# EAGLE design esp8266-hw9 (EAGLE 9.5.2)
ESP8266 HW
CNAME: Sensorboard; CREVISION: HW7; DESIGNER: Pär Sundbäck
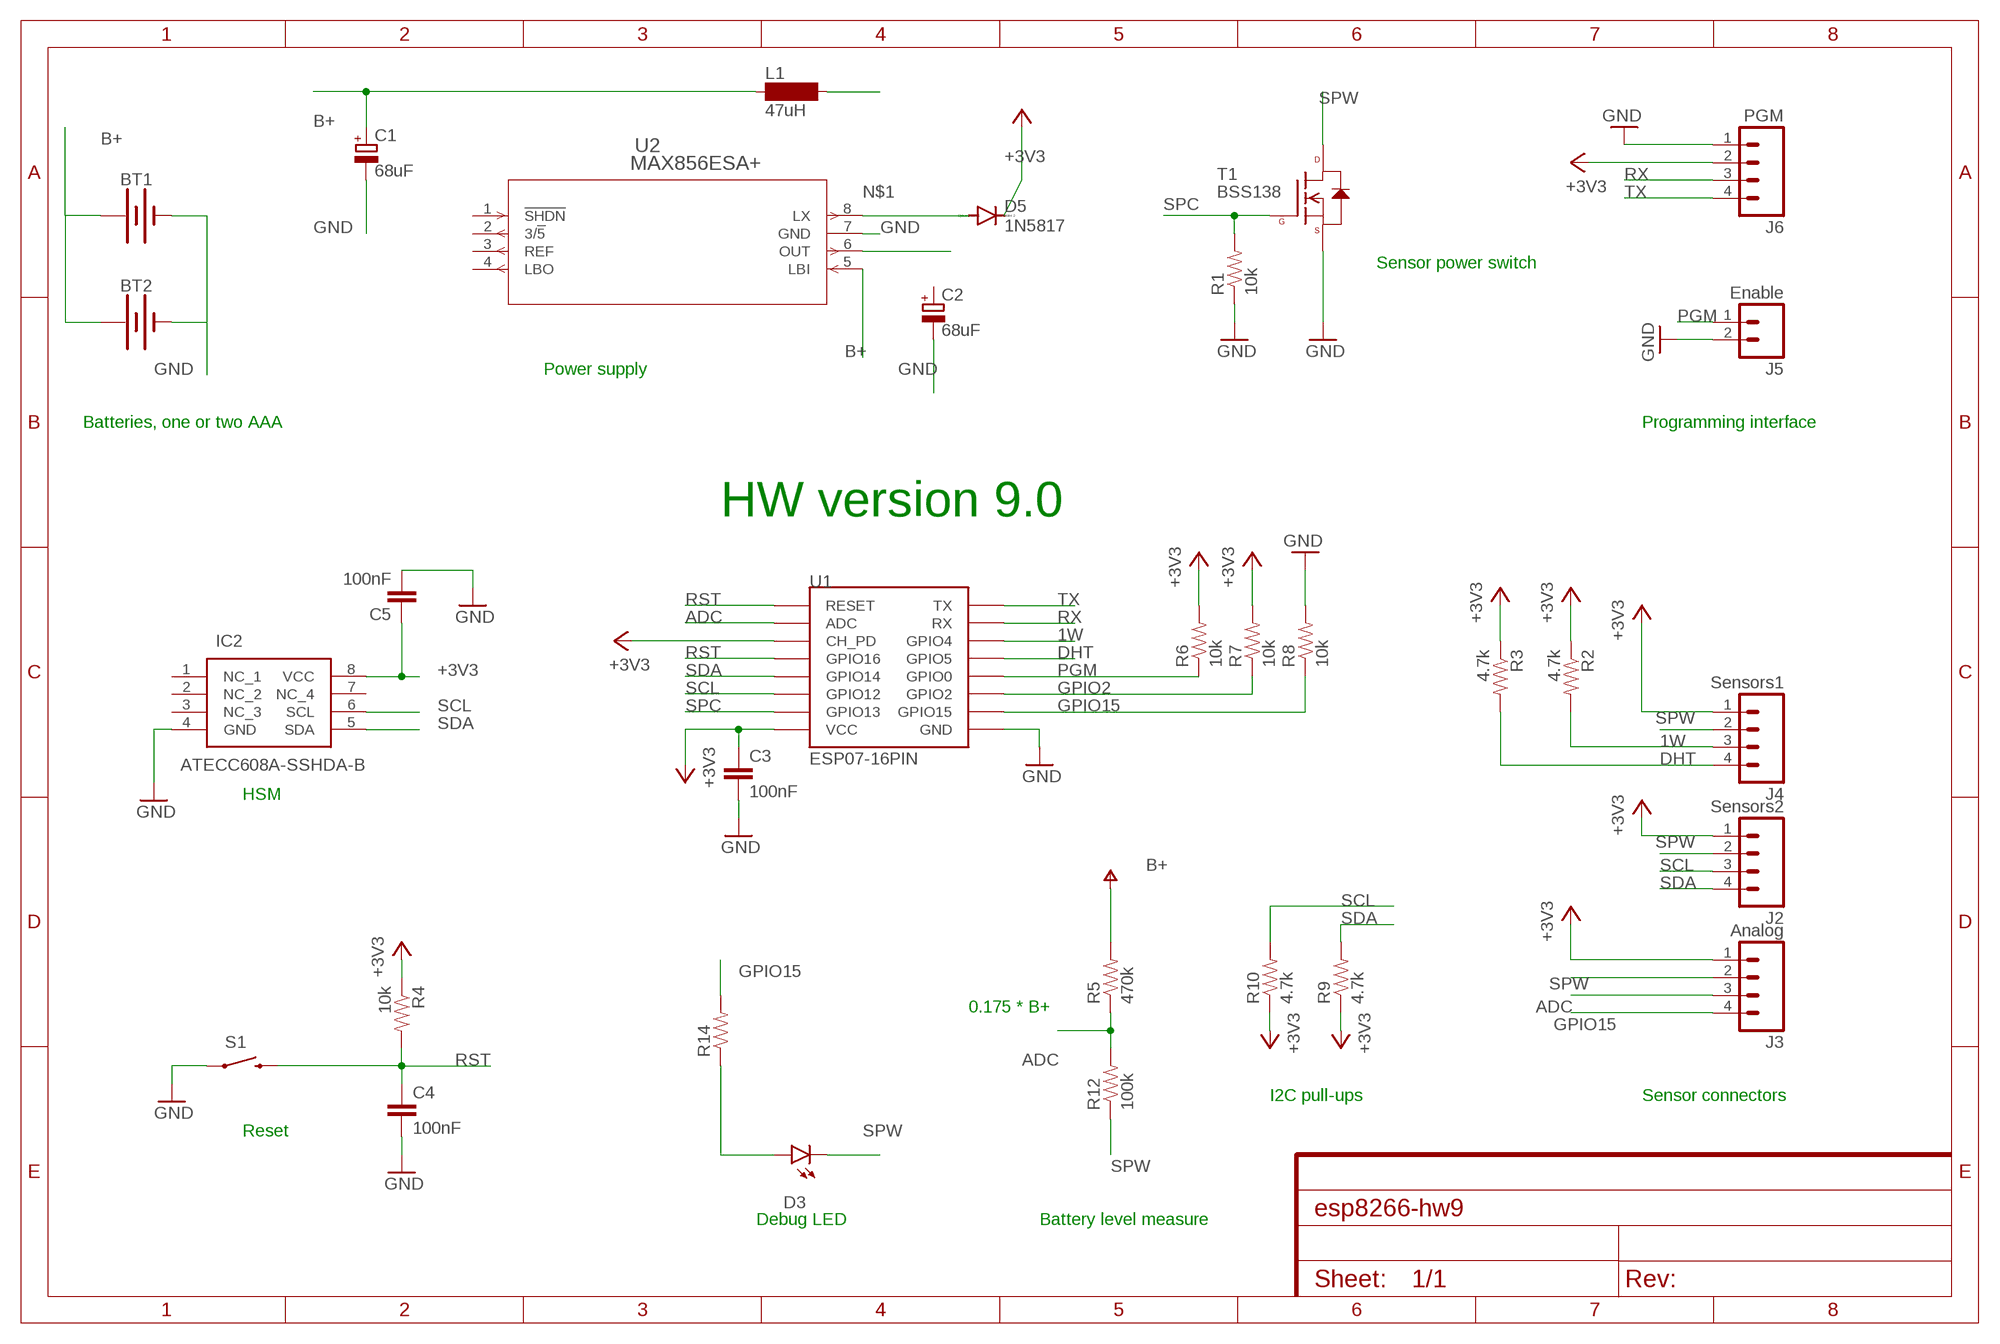
[diagram p0: schematic, sheet 1]

## Parts
BT1  BATTERY-AAA  [BATTERY-AAA]
BT2  BATTERY-AAA  [BATTERY-AAA]
C1  68uF  CPOL-EUE2.5-6  [E2,5-6]
C2  68uF  CPOL-EUE2.5-6  [E2,5-6]
C3  100nF  CAP0805  [0805]
C4  100nF  CAP0805  [0805]
C5  100nF  CAP0805  [0805]
D3  LED3MM  [LED_3MM]
D5  1N5817  DIODE-DO41-10  [DO41-10]
IC2  ATECC608A-SSHDA-B  [SOIC127P600X175-8N]
J2  Sensors2  M04PTH  [1X04]
J3  Analog  M04PTH  [1X04]
J4  Sensors1  M04PTH  [1X04]
J5  Enable  M02PTH  [1X02]
J6  PGM  M04PTH  [1X04]
L1  47uH  SM-1206  [SM-1206]
R1  10k  RESISTOR0805-RES  [0805]
R2  4.7k  RESISTOR0805-RES  [0805]
R3  4.7k  RESISTOR0805-RES  [0805]
R4  10k  RESISTOR0805-RES  [0805]
R5  470k  RESISTOR0805-RES  [0805]
R6  10k  RESISTOR0805-RES  [0805]
R7  10k  RESISTOR0805-RES  [0805]
R8  10k  RESISTOR0805-RES  [0805]
R9  4.7k  RESISTOR0805-RES  [0805]
R10  4.7k  RESISTOR0805-RES  [0805]
R12  100k  RESISTOR0805-RES  [0805]
R14  470  RESISTOR0805-RES  [0805]
S1  RESET  SWITCH-MOMENTARY-2SMD-1101NE  [TACTILE-SWITCH-1101NE]
T1  BSS138  N-CHANNEL-MOSFET-BSS138  [SOT23-3]
U1  ESP07-16PIN  [ESP07-16PIN]
U2  MAX856ESA+  [21-0041B_8]

## Nets
1W: J4.3 R2.2 U1.GPIO4
+3V3: C3.1 C5.1 D5.C IC2.8(VCC) J2.1 J3.1 J4.1 J6.2 R2.1 R3.1 R4.1 R6.2 R7.2 R9.1 R10.1 U1.CH_PD U1.VCC
ADC: J3.3 R5.1 R12.2 U1.ADC
B+: BT1.PWR@1(+) BT2.PWR@1(+) C1.+ L1.1 R5.2 U2.5(LBI) ; supply symbol labelled V+
DHT: J4.4 R3.2 U1.GPIO5
GND: BT1.GND@1(-) BT2.GND@1(-) C1.- C2.- C3.2 C4.2 C5.2 IC2.4(GND) J5.2 J6.1 R1.1 R8.2 S1.1 T1.2(S) U1.GND U2.7(GND)
GPIO2: R7.1 U1.GPIO2
GPIO15: J3.4 R8.1 R14.2 U1.GPIO15
LX: L1.2
N$1: D5.A U2.8(LX)
N$2: U2.6(OUT)
N$8: D3.A R14.1
PGM: J5.1 R6.1 U1.GPIO0
RST: C4.1 R4.2 S1.2 U1.GPIO16 U1.REST(RESET)
RX: J6.3 U1.RX
SCL: IC2.6(SCL) J2.3 R10.2 U1.GPIO12
SDA: IC2.5(SDA) J2.4 R9.2 U1.GPIO14
SPC: R1.2 T1.1(G) U1.GPIO13
SPW: D3.K(C) J2.2 J3.2 J4.2 R12.1 T1.3(D)
TX: J6.4 U1.TX
Unconnected: C2.+ IC2.1(NC_1) IC2.2(NC_2) IC2.3(NC_3) IC2.7(NC_4) U2.1(!SHDN) U2.2(3/!5) U2.3(REF) U2.4(LBO)

## Notes on the sheet
- Sensor power switch
- Power supply
- Batteries, one or two AAA | Programming interface
- HW version 9.0
- HSM
- 0.175 * B+
- I2C pull-ups | Sensor connectors
- Reset
- Debug LED | Battery level measure

## Library data of the parts
BT1 BT2 = SparkFun-Batteries:BATTERY: Battery - Single Cell A variety of battery chemistries, sizes, and footprints. Device List: 20MM_PTH - Coin Cell Battery Holder - 20mm (PTH) <https://www.sparkfun.com/products/783> 6.8MM_PTH - Coin Cell Battery Holder - 6.8MM(SMD) <https://www.digikey.com/product-detail/en/seiko-instruments/MS621FE-FL11E/728-1057-ND/1889208?WT.srch=1&gclid=CNOQ5a6LzdQCFZS2wAodXCkE0g> 12MM_SMD - Coin Cell Battery Holder - 12mm (SMD) <https://www.sparkfun.com/products/10592> 12MM_PTH - Coin Cell Battery Holder - 12mm (PTH) <https://www.sparkfun.com/products/7948> 20MM_SMD - 20mm Coin Cell Battery Holder (SMD) (2 legs) Used on the Big Time Watch Kit <https://www.sparkfun.com/products/11734> 20MM_SMD_4LEGS - Coin Cell Battery Holder - 20mm (SMD) <https://www.sparkfun.com/products/11892> 20MM_SMD_4LEGS_OVERPASTE - Coin Cell Battery Holder - 20mm (SMD) <https://www.sparkfun.com/products/11892> (Over-paste on the legs) 24.5MM_PTH - Coin Cell Battery Holder - 24.5mm (PTH) <https://www.sparkfun.com/products/8863> 9V - 9V Battery Holder - PC Mount Used on the SparkFun SparkPunk Sound Kit <https://www.sparkfun.com/products/11177> and SparkFun SparkPunk Sequencer Kit <https://www.sparkfun.com/products/12707> 18650 - Battery Holder - 18650 (PTH) <https://www.sparkfun.com/products/13113> AA - Battery Holder - 1xAA (PTH) <https://www.sparkfun.com/products/7949> AAA - Battery Holder - 1xAAA (PTH) <https://www.sparkfun.com/products/12718> AA_KIT - Battery Holder - 1xAA (PTH) <https://www.sparkfun.com/products/7949> Special kit package - pads only have exposed copper on one side of the board. AAA_KIT - Battery Holder - 1xAAA (PTH) <https://www.sparkfun.com/products/12718> Special kit package - pads only have exposed copper on one side of the board.; PROD_ID: BATT-08571; SF_SKU: PRT-12718
C1 C2 = resistor:CPOL-EU: POLARIZED CAPACITOR, European symbol
C3-C5 = SparkFun-Passives:CAP: Capacitor Standard 0603 ceramic capacitor, and 0.1" leaded capacitor.
D3 = SparkFun-LED:LED: LED (Generic) Standard schematic elements and footprints for 5mm, 3mm, 1206, and 0603 sized LEDs. Generic LEDs with no color specified.; PROD_ID: DIO-08794
D5 = diode:DIODE-: DIODE
IC2 = SamacSys_Parts:ATECC608A-SSHDA-B: Cryptoathentication ECC608A SOIC Source: Datasheet <https://componentsearchengine.com/Datasheets/1/ATECC608A-SSHDA-B.pdf>; DESCRIPTION: Cryptoathentication ECC608A SOIC; HEIGHT: 1.75mm; MANUFACTURER_NAME: Microchip; MANUFACTURER_PART_NUMBER: ATECC608A-SSHDA-B; MOUSER_PART_NUMBER: 556-ATECC608ASSHDAB; MOUSER_PRICE-STOCK: https://www.mouser.com/Search/Refine.aspx?Keyword=556-ATECC608ASSHDAB
J2-J4 J6 = SparkFun-Connectors:M04: Header 4 Standard 4-pin 0.1" header. Use with straight break away headers (SKU : PRT-00116), right angle break away headers (PRT-00553), swiss pins (PRT-00743), machine pins (PRT-00117), and female headers (PRT-00115). Molex polarized connector foot print use with SKU : PRT-08231 with associated crimp pins and housings. 1MM SMD Version SKU: PRT-10208; PROD_ID: CONN-09696
J5 = SparkFun-Connectors:M02: Standard 2-pin 0.1" header. Use with - straight break away headers ( PRT-00116) - right angle break away headers (PRT-00553) - swiss pins (PRT-00743) - machine pins (PRT-00117) - female headers (PRT-00115) Molex polarized connector foot print use with: PRT-08233 with associated crimp pins and housings. 2.54_SCREWTERM for use with PRT-10571. 3.5mm Screw Terminal footprints for PRT-08084 5mm Screw Terminal footprints for use with PRT-08432
L1 = inductor-neosid:SM-1206: INDUCTOR SMD chip inductor; OC_FARNELL: unknown; OC_NEWARK: unknown
R1-R10 R12 R14 = SparkFun-Resistors:RESISTOR: Resistor Basic schematic elements and footprints for 0603, 1206, and PTH resistors.
S1 = SparkFun-Electromechanical:SWITCH-MOMENTARY-2: Various NO switches- pushbuttons, reed, etc; PROD_ID: SWCH-00815
T1 = GeekAmmo:N-CHANNEL-MOSFET: N-Channel MOSFET Mode Field Effect Transistor; DATASHEET: http://www.fairchildsemi.com/ds/BS/BSS138.pdf; DIGIKEY: BSS138TR-ND; ELEMENT14: 2323154; URL: http://au.element14.com/fairchild-semiconductor/bss138/mosfet-n-ch-50v-220ma-sot-23/dp/2323154
U1 = esp8266modules:ESP07-16PIN: ESP8266 Wifi module 07 - 16 pins; DIMENSIONS: 22.0 x 16.0 mm; PINS: 16; PITCH: 0.078" / 2 mm
U2 = max856:MAX856ESA+; MANUFACTURER_PART_NUMBER: MAX856ESA+; VENDOR: Maxim Integrated Products

## Board
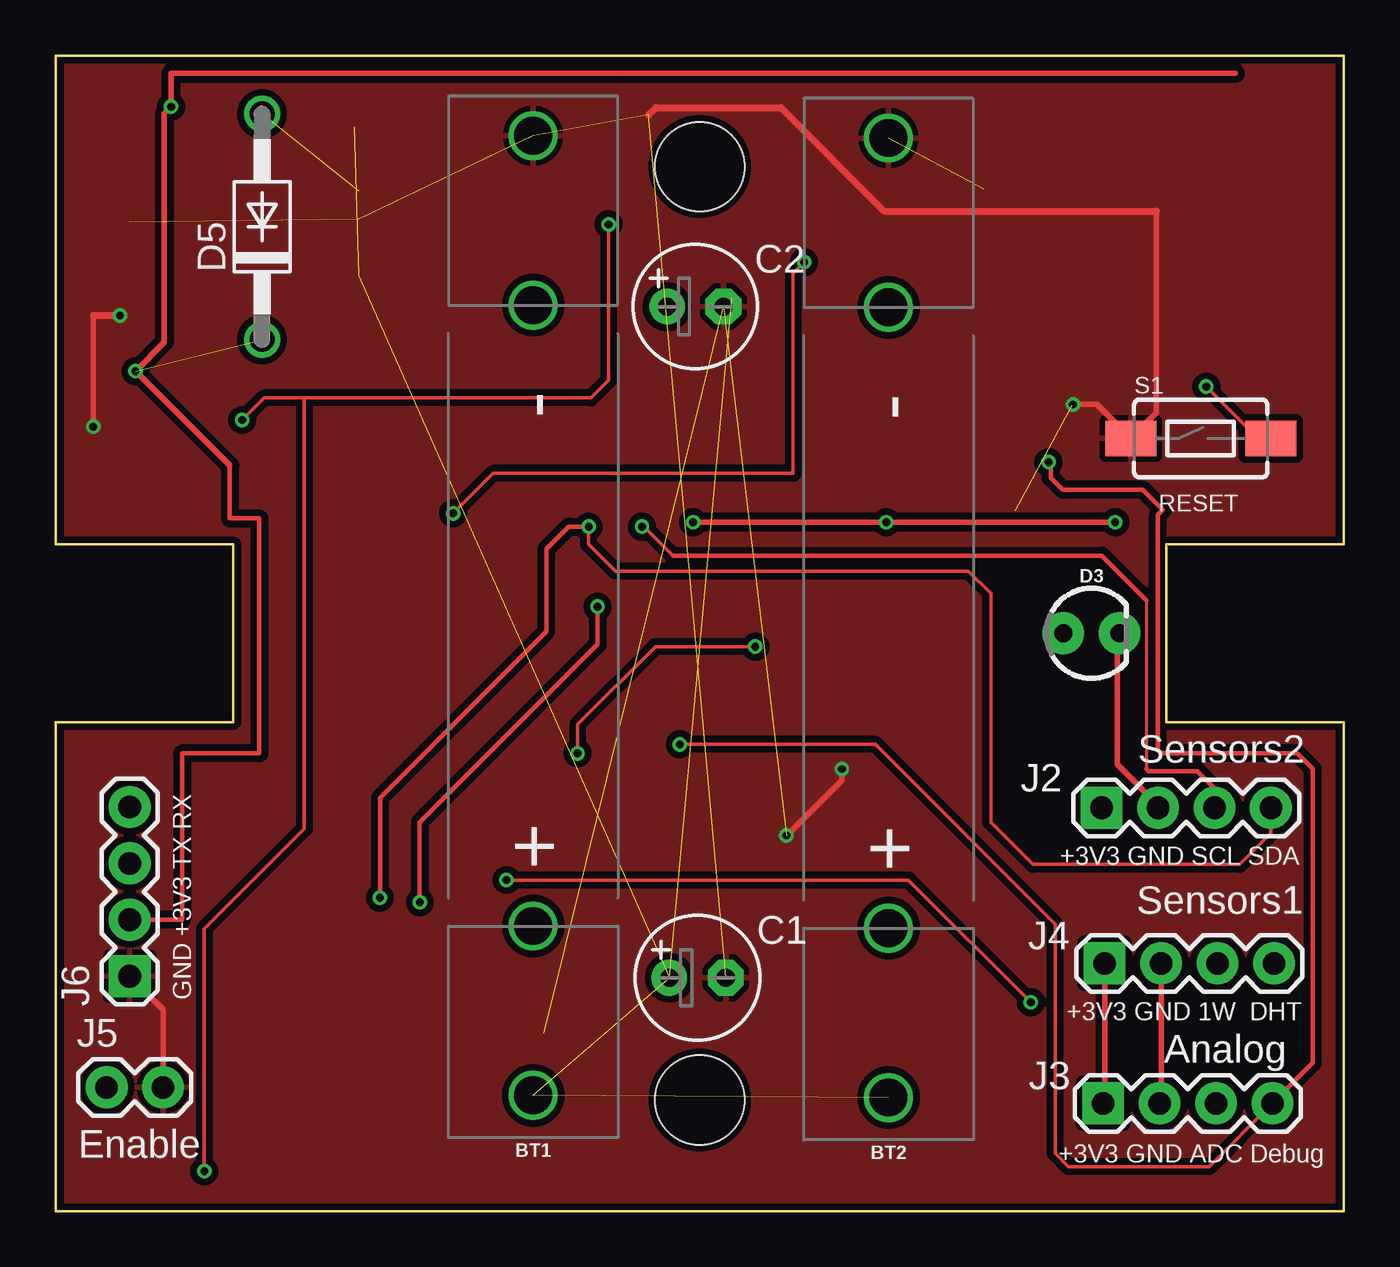
[diagram p1: board, top side]
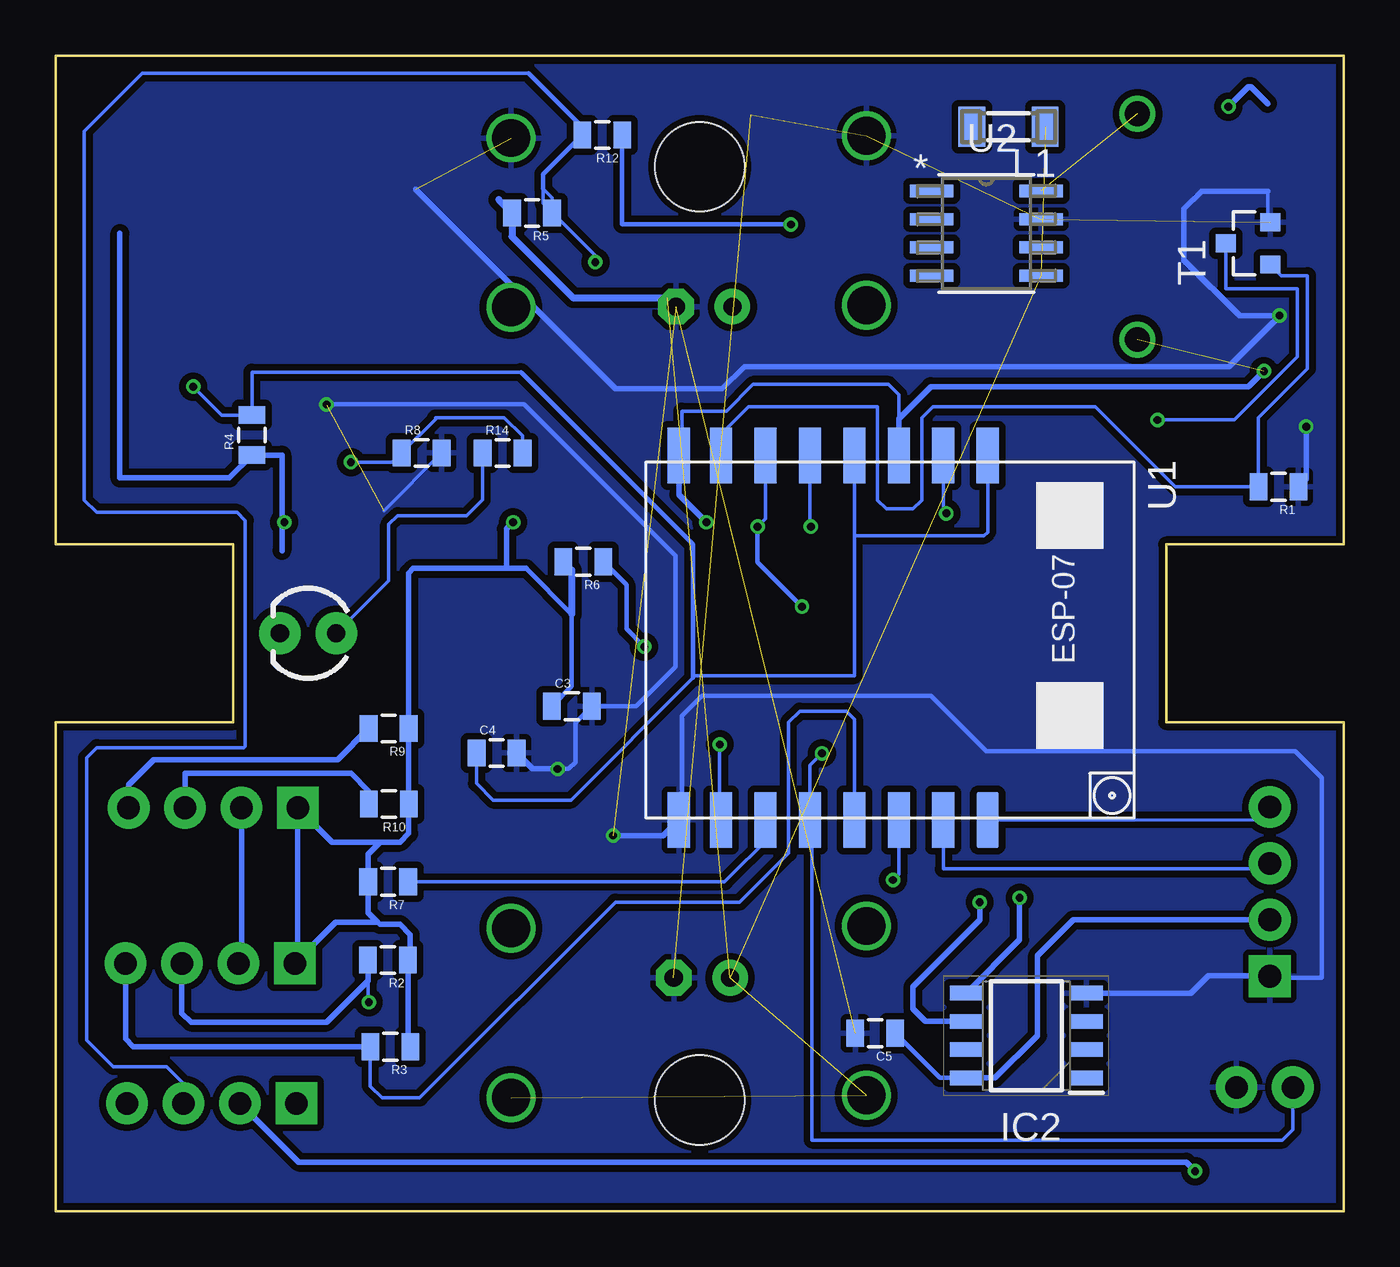
[diagram p2: board, bottom side, seen from below]

Size 58 x 52 mm. Coordinates in mm from the lower left corner, seen from the top.
Outline: 0,0 58,0 58,22 50,22 50,30 58,30 58,52 0,52 0,30 8,30 8,22 0,22 0,0
Copper layers (1*16): Top 0.035mm / dielectric 1.5mm / Bottom 0.035mm
Design rules "aisler_2_layer": minimum track width 0.1mm, minimum drill 0.2mm, track to track 0.1mm, track to pad 0.1mm, pad to pad 0.1mm, via to via 0.1mm, smd to smd 0.1mm, copper to edge 0.2mm, drill to drill 0.21mm, minimum pad ring 0.25mm, minimum via ring 0.15mm, stop-mask expansion 0mil, vias tented up to drill 0mil, thermal gap 10mil
Holes 4 mm at 29,47 29,5

### Footprints (pad centres in the part's own frame; a part is rotated, then mirrored left to right if it is on the bottom)
BATTERY-AAA = drill 1.702: GND@1 21.59,0; GND@2 13.97,0; PWR@1 -21.59,0; PWR@2 -13.97,0
E2,5-6 = drill 0.813 pad 1.6: + -1.27,0 | drill 0.813 pad 1.6 octagon: - 1.27,0
0805 = smd 0.8 x 1.2: 1 -0.9,0; 2 0.9,0
LED_3MM = drill 0.813 pad 1.88: A -1.27,0; K 1.27,0
DO41-10 = drill 1.118: A 5.08,0; C -5.08,0
SOIC127P600X175-8N = smd 1.5 x 0.65: 1 -2.7,1.905; 2 -2.7,0.635; 3 -2.7,-0.635; 4 -2.7,-1.905; 5 2.7,-1.905; 6 2.7,-0.635; 7 2.7,0.635; 8 2.7,1.905
1X04 = drill 1.016 pad 1.88 square: 1 0,0 | drill 1.016 pad 1.88: 2 2.54,0; 3 5.08,0; 4 7.62,0
1X02 = drill 1.016 pad 1.88: 1 0,0; 2 2.54,0
SM-1206 = smd 1.2 x 1.8: 1 -1.65,0; 2 1.65,0
TACTILE-SWITCH-1101NE = smd 2.3 x 1.6: 1 -3.15,0; 2 3.15,0
SOT23-3 = smd 0.8 x 0.9: 1 -0.95,-1; 2 0.95,-1; 3 0,1
ESP07-16PIN = smd 2.5 x 1: ADC -8.2,3.8; CH_PD -8.2,1.8; GND 8.2,-8.105; GPIO0 8.2,-2.2; GPIO2 8.2,-4.2; GPIO4 8.2,1.8; GPIO5 8.2,-0.2; GPIO12 -8.2,-4.2; GPIO13 -8.2,-6.2; GPIO14 -8.2,-2.2; GPIO15 8.2,-6.2; GPIO16 -8.2,-0.2; REST -8.2,5.8; RX 8.2,3.8; TX 8.2,5.8; VCC -8.2,-8.105
21-0041B_8 = smd 1.97 x 0.543: 1 -2.464,1.905; 2 -2.464,0.635; 3 -2.464,-0.635; 4 -2.464,-1.905; 5 2.464,-1.905; 6 2.464,-0.635; 7 2.464,0.635; 8 2.464,1.905

### Placement (x,y rotation side)
BT1  21.5,26.8 90 top
BT2  37.5,26.7 90 top
C1  28.9,10.5 0 top
C2  28.8,40.7 0 top
C3  34.76,22.72 0 bottom
C4  38.15,20.62 0 bottom
C5  21.1,8 180 bottom
D3  46.63,26 0 top
D5  9.3,44.3 90 top
IC2  14.3,7.9 180 bottom
J2  47.09,18.15 0 top
J3  47.16,4.85 0 top
J4  47.23,11.15 0 top
J5  2.3,5.57 0 top
J6  3.34,10.57 90 top
L1  15.1,48.8 180 bottom
R1  2.95,32.6 180 bottom
R2  43.04,11.3 180 bottom
R3  42.93,7.4 180 bottom
R4  49.16,34.92 90 bottom
R5  36.55,44.92 180 bottom
R6  34.24,29.22 180 bottom
R7  43.03,14.82 180 bottom
R8  41.52,34.12 0 bottom
R9  43.01,21.72 180 bottom
R10  43,18.32 180 bottom
R12  33.39,48.42 180 bottom
R14  37.88,34.12 0 bottom
S1  51.55,34.77 0 top
T1  4.32,43.55 90 bottom
U1  21.84,25.8 270 bottom
U2  16.1,44 0 bottom

### Tracks (layer width: path | path; a pad name or v marks a point on that pad's centre or on a via)
1W  (via drill 0.35)
  Top 0.152: v43.9,9.4 38.4,14.9 v20.3,14.9
  Bottom 0.152: 43.94,10.36 43.94,9.44 v43.9,9.4 | U1.GPIO4 20.04,15.16 v20.3,14.9
  Bottom 0.254: J4.3 52.31,8.91 51.9,8.5 45.8,8.5 43.94,10.36 R2.2
+3V3  (via drill 0.35)  (1 unrouted)
  Top 0.203: 7.84,33.56 7.84,31.17 9.17,31.17 9.17,20.6 5.7,20.6 5.7,13.11 J6.2
  Top 0.254: J4.1 47.23,4.92 J3.1 | 7.84,33.56 v3.6,37.8 4.9,39.1 4.9,49.4 v5.2,49.7 5.2,51.2 53.12,51.2 | v47.7,31 v37.4,31 v28.7,31
  Bottom 0.152: U1.CH_PD 20.04,36.74 20.5,37.2 26.6,37.2 27.8,36 29.8,36 29.8,34.15 U1.VCC
  Bottom 0.2: 36.82,28.92 34.76,26.86 34.76,23.62 C3.1 | IC2.8 18.2,6 C5.1
  Bottom 0.254: 37.7,28.92 41.9,28.92 42.11,28.71 R9.1 R10.1 42.1,17 42.5,16.6 43.4,16.6 | 37.7,28.92 36.82,28.92 | R3.1 42.14,7.51 R2.1 42.03,11.41 42.03,12.43 42.5,12.9 43.4,12.9 43.5,13 | U1.CH_PD 20.04,35.66 18.6,37.1 4.3,37.1 v3.6,37.8 | 43.4,16.6 43.93,16.07 R7.2 43.93,13.43 43.5,13 | 43.4,16.6 45.54,16.6 J2.1 47.09,11.29 J4.1 45.38,13 43.5,13 | 55.1,44 55.1,33 50.18,33 R4.1 47.8,34.02 47.8,30.9 | v47.7,31 47.8,30.9 | 47.8,30.9 47.8,29.72 | U1.VCC 29.95,32.24 v28.7,31 | v37.4,31 37.7,30.7 37.7,28.92 | v5.2,49.7 4.3,50.6 4.2,50.6 3.44,49.84 | IC2.8 15.71,6 13.8,7.9 13.8,11.5 12.19,13.11 J6.2
  Bottom 0.305: R6.2 34.76,28.84 34.76,26.86
ADC  (via drill 0.35)
  Top 0.152: v33.7,42.7 33.2,42.2 33.2,33.2 19.7,33.2 v17.9,31.4
  Bottom 0.152: J3.3 52.24,5.74 53,6.5 55.4,6.5 56.6,7.7 56.6,20.4 56.14,20.86 49.53,20.86 49.46,20.93 49.46,31.07 49.83,31.44 56.14,31.44 56.7,32 56.7,48.6 54.09,51.21 36.71,51.21 | R5.1 35.65,45.6 36.05,46 36.05,45.35 33.7,43 v33.7,42.7 | U1.ADC 18.04,31.54 v17.9,31.4
  Bottom 0.2: 36.71,51.21 34.29,48.79 R12.2 36.05,46.66 36.05,46
B+  (5 unrouted)
  Bottom 0.305: 38.05,45.52 R5.2 37.45,43.85 34.7,41.1 30.45,41.1
DHT
  Bottom 0.152: R3.2 43.83,5.63 43.3,5.1 41.6,5.1 32.8,13.9 27.2,13.9 25,16.1 25,22 24.5,22.5 22.4,22.5 22.04,22.14 U1.GPIO5
  Bottom 0.254: J4.4 54.85,7.75 54.5,7.4 R3.2
GND  (via drill 0.35)  (8 unrouted)
  Top 0.254: 49.56,45 49.56,35.93 S1.1 46.87,36.3 v45.8,36.3 | J5.2 4.84,9.07 J6.1 | 1.7,40.3 v1.7,35.3 | v35.4,19.9 35.4,19.4 v32.9,16.9
  Top 0.305: 26.7,49.33 27.03,49.65 32.65,49.65 37.3,45 49.56,45 | v2.9,40.3 1.7,40.3
  Bottom 0.152: R8.2 43.22,31.52 | 3.44,45.9 3.44,44.62 T1.2
  Bottom 0.2: v35.4,19.9 34.9,19.9 34.6,20.2 34.6,21.98 C3.2 31.88,22.72 30.1,24.5 30.1,29.5 36.9,36.3 v45.8,36.3 | U1.GND 29.8,17.75 29.8,22.3 28.9,23.2 18.6,23.2 16.1,20.7 2.2,20.7 1,19.5 1,10.5 3.27,10.5 J6.1
  Bottom 0.254: C4.2 36.53,19.9 v35.4,19.9 | 41.78,45.98 32.8,37 28,37 27,38.01 5.19,38.01 v2.9,40.3 4.7,40.3 7.2,42.8 7.2,45.1 6.4,45.9 3.44,45.9 | v32.9,16.9 30.64,16.9 U1.GND | v45.8,36.3 45.77,36.27 | R1.1 1.7,32.95 v1.7,35.3 | IC2.4 6.89,9.8 6.1,10.6 3.37,10.6 J6.1
  pour Top (isolate 0.305): 0,-0.1 58,-0.1 58,0.4 58,52.1 57.9,52.1 -0.1,52.1 -0.1,51.9 -0.1,-0.1
  pour Bottom (isolate 0.305): -0.1,0 58.1,0 58.1,0.1 58.1,52.1 58,52.1 -0.1,52.1 -0.1,51.9
GPIO2
  Bottom 0.152: R7.1 27.88,14.82 25.8,16.9 25.8,17.36 U1.GPIO2
GPIO15  (via drill 0.35)
  Top 0.152: J3.4 51.93,2 45.6,2 45,2.6 45,12.9 36.9,21 v28.1,21 | v44.7,33.7 44.8,33.7
  Top 0.203: J3.4 56.6,6.67 56.6,19.9 55.9,20.6 49.8,20.6 49.63,20.77 49.63,31.33 49.85,31.55 48.95,32.45 45.35,32.45 44.8,33 44.8,33.7
  Bottom 0.152: v28.1,21 28.1,17.66 U1.GPIO15 | R14.2 36.98,34.88 37.8,35.7 40.9,35.7 40.9,35.64 R8.1 42.84,33.7 v44.7,33.7
N$1  (1 unrouted)
N$8
  Bottom 0.152: D3.A 43,28.36 43,30.9 42.6,31.3 39.5,31.3 38.78,32.02 R14.1
PGM  (via drill 0.35)
  Top 0.152: v31.5,25.4 27,25.4 23.5,21.9 v23.5,20.6
  Bottom 0.152: J5.1 2.3,3.67 2.77,3.2 23.94,3.2 23.94,17.2 24.04,17.3 U1.GPIO0 24.04,20.06 v23.5,20.6
  Bottom 0.2: R6.1 32.3,28.18 32.3,26.2 v31.5,25.4
RST  (via drill 0.35)
  Top 0.152: S1.2 54.13,34.77 v51.8,37.1
  Bottom 0.152: v51.8,37.1 50.52,35.82 R4.2 49.16,37.75 37.05,37.75 | C4.1 39.05,19.25 38.3,18.5 34.8,18.5 29.3,24 29.2,24.1 22.04,24.1 22.04,30.36 | 22.04,30.36 U1.GPIO16 | 22.04,30.36 22,30.4 16.2,30.4 16.04,30.56 U1.REST
  Bottom 0.2: 37.05,37.75 29.3,30 29.3,24
RX
  Bottom 0.152: U1.RX 18.04,15.4 3.8,15.4 3.55,15.65 J6.3
SCL  (via drill 0.35)
  Top 0.127: 49.1,27.5 49.1,19.9
  Top 0.152: 27.8,29.5 26.5,30.8 v26.4,30.8
  Top 0.2: v24.4,27.2 24.4,25.5 16.4,17.5 v16.4,13.9
  Top 0.203: 27.8,29.5 47.1,29.5 49.1,27.5 | J2.3 52.17,19.03 51.4,19.8 49.2,19.8 49.1,19.9
  Bottom 0.152: U1.GPIO12 26.04,31.16 v26.4,30.8
  Bottom 0.2: v26.4,30.8 26.4,29.2 v24.4,27.2
  Bottom 0.254: R10.2 43.9,18.9 44.7,19.7 52.17,19.7 J2.3 | IC2.6 18.84,8.54 19.4,9.1 19.4,10.1 16.4,13.1 v16.4,13.9
SDA  (via drill 0.35)
  Top 0.152: J2.4 54.71,17.01 53.3,15.6 44,15.6 42.1,17.5 42.1,27.8 41.1,28.8 25.2,28.8 24,30 v24,30.8
  Top 0.2: v14.6,14.1 14.6,18.6 22.1,26.1 22.1,29.8 23.1,30.8 v24,30.8
  Bottom 0.152: U1.GPIO14 24.04,30.84 v24,30.8
  Bottom 0.254: J2.4 54.71,19.19 53.58,20.32 45.31,20.32 R9.2 | IC2.5 14.6,12.21 v14.6,14.1 14.6,14.2
SPC
  Bottom 0.152: U1.GPIO13 28.04,34.96 26.8,36.2 21,36.2 21,32 20.6,31.6 19.4,31.6 19,32 19,35.7 18.5,36.2 11.2,36.2 7.6,32.6 R1.2 3.85,35.7 1.64,37.91 1.64,42.1 2.82,42.1 T1.1
SPW  (via drill 0.35)
  Top 0.152: v24.9,44.4 24.9,37.4 24.1,36.6 11.2,36.6 | v8.4,35.6 9.4,36.6 11.2,36.6 | 11.2,36.6 11.2,17.2 6.7,12.7 v6.7,1.8
  Top 0.254: J4.2 49.77,4.92 J3.2 | D3.K 47.8,25.9 47.8,20.1 49.63,18.27 J2.2
  Bottom 0.152: T1.3 5.32,41.5 2.1,41.5 2.1,38.44 4.94,35.6 v8.4,35.6
  Bottom 0.2: v24.9,44.4 32.49,44.4 R12.1
  Bottom 0.254: J2.2 49.63,11.29 J4.2 | J3.2 47.05,2.2 7.1,2.2 v6.7,1.8
TX
  Bottom 0.127: U1.TX 3.93,17.6 J6.4

### Text on the board
tNames: +3V3 GND SCL SDA | GND +3V3 TX RX | +3V3 GND 1W DHT | +3V3 GND ADC Debug